# Altium schematic sheet Cores POWER.SchDoc
size A4
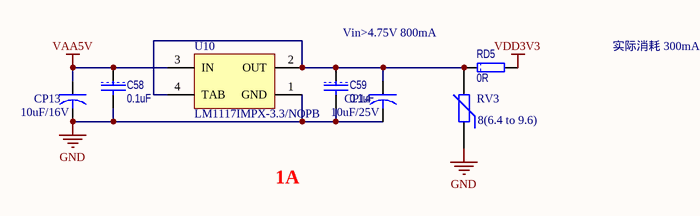
[diagram p0: Cores POWER.SchDoc]

## Parts
C58  0.1uF  [1608[0603]]
C59  0.1uF  [1608[0603]]
CP13  10uF/16V  [3216[1206]]
CP14  10uF/25V  [6032]
RD5  0R  [0603RT]
RV3  8(6.4 to 9.6)  [0603RV]
U10  LM1117IMPX-3.3/NOPB  [MP04A_N]

## Nets
GND: C58.2 C59.2 CP13.2 CP14.2 RV3.1 U10.1(GND)
VAA5V: C58.1 CP13.1 U10.3(IN)
VDD3V3: RD5.2
NetC59_1: C59.1 CP14.1 RD5.1 RV3.2 U10.2(OUT) U10.4(TAB)

## Notes on the sheet
- Vin>4.75V 800mA
- 实际消耗 300mA
- 1A

## Library data of the parts
C58 C59 = CAP: Capacitor; Manufacturer: TDK; Type: 无铅电容; Model: C0603X7R1H104K; Value: 0.1uF
CP13 CP14 = CAPACITOR: Tantalum Capacitor; Compy: TAJ; name: TAJ-A-106-M-010-R
RD5 = RES: Manufacturer: vishay; Model: RT0603DRD7D0RL; Value: 0R; Type: 无铅电阻
RV3 = Res Varistor: 压敏电阻; Manufacture: TDK; Value: AVR-M1608C080MAAB; Published: 24-Mar-1999; LatestRevisionDate: 29-May-2009; LatestRevisionNote: IPC-7351 Footprint Added.; PackageVersion: Mar-2003; PackageReference: 6-0805; Publisher: Altium Limited; PackageDescription: Chip Resistor 0805 Case Size; Code_IPC: RESC2012
U10 = LM1117MPX-3.3/NOPB: 800mA Low-Dropout Linear Regulator, 4-pin SOT-223, Pb-Free; Manufacturer: National Semiconductor; PackageTopMarking: XYTT*N05A; PowerWise: N; CompType: LDO IC; Published: 1-Mar-2010; DatasheetVersion: Apr-2006; PackageVersion: revB, Apr-2003; PackageReference: MP04A; Publisher: Altium Limited; PackageDescription: Molded SOT-223, 6.50 x 3.56 x 1.6mm Body, 4 Lead, 2.3mm Pitch; Supplier 1: Digi-Key; Supplier Part Number 1: LM1117MPX-3.3TR-ND; Supplier 2: Digi-Key; Supplier Part Number 2: LM1117MPX-3.3CT-ND; Supplier 3: Digi-Key; Supplier Part Number 3: LM1117MPX-3.3DKR-ND; PartNumber: LM1117MPX-3.3/NOPB; RoHS: Y; PinCount: 4; Code_JEDEC: TO-261-AA; Code_IPC: SOT223-4; ComponentLink1Description: LM1117 Datasheet; ComponentLink1URL: http://www.national.com/ds/LM/LM1117.pdf; ComponentLink2Description: LM1117 Web Page; ComponentLink2URL: http://www.national.com/pf/LM/LM1117.html; ComponentLink3Description: MP04A Package Page; ComponentLink3URL: http://www.national.com/packaging/folders/mp04a.html